# Altium schematic sheet Output.SchDoc
size A; SheetNumber: 6; SheetTotal: 6
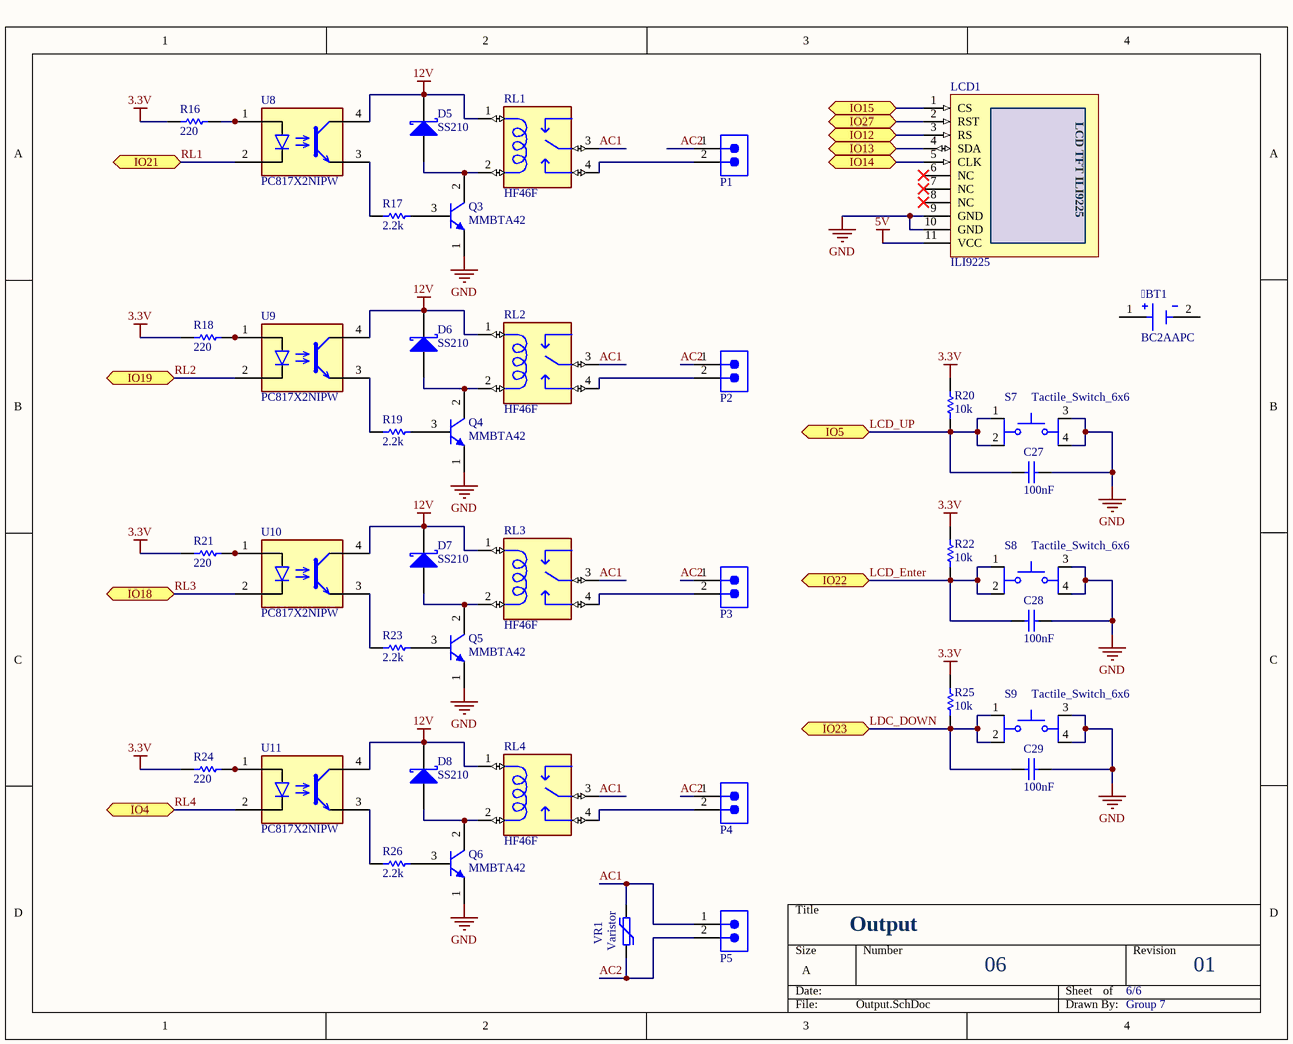
[diagram p0: Output.SchDoc]

## Parts
BT1  BC2AAPC  [BC2AAPC]
C27  100nF  [CAP_0603]
C28  100nF  [CAP_0603]
C29  100nF  [CAP_0603]
D5  SS210  [SS34]
D6  SS210  [SS34]
D7  SS210  [SS34]
D8  SS210  [SS34]
LCD1  ILI9225  [LCD TFT ILI9225]
P1  691322310002  [691322310002]  (value not drawn)
P2  691322310002  [691322310002]  (value not drawn)
P3  691322310002  [691322310002]  (value not drawn)
P4  691322310002  [691322310002]  (value not drawn)
P5  691322310002  [691322310002]  (value not drawn)
Q3  MMBTA42  [SOT23B]
Q4  MMBTA42  [SOT23B]
Q5  MMBTA42  [SOT23B]
Q6  MMBTA42  [SOT23B]
R16  220  [resistor_0603]
R17  2.2k  [resistor_0603]
R18  220  [resistor_0603]
R19  2.2k  [resistor_0603]
R20  10k  [resistor_0603]
R21  220  [resistor_0603]
R22  10k  [resistor_0603]
R23  2.2k  [resistor_0603]
R24  220  [resistor_0603]
R25  10k  [resistor_0603]
R26  2.2k  [resistor_0603]
RL1  HF46F  [HF46F]
RL2  HF46F  [HF46F]
RL3  HF46F  [HF46F]
RL4  HF46F  [HF46F]
S7  Tactile_Switch_6x6  [Tactile_Switch_6x6]
S8  Tactile_Switch_6x6  [Tactile_Switch_6x6]
S9  Tactile_Switch_6x6  [Tactile_Switch_6x6]
U8  PC817X2NIPW  [PC817XI_SHP]
U9  PC817X2NIPW  [PC817XI_SHP]
U10  PC817X2NIPW  [PC817XI_SHP]
U11  PC817X2NIPW  [PC817XI_SHP]
VR1  Varistor  [07D471K]

## Ports
IO4 (bidir), IO5 (bidir), IO12 (bidir), IO13 (bidir), IO14 (bidir), IO15 (bidir), IO18 (bidir), IO19 (bidir), IO21 (bidir), IO22 (bidir), IO23 (bidir), IO27 (bidir)

## Nets
3.3V: R16.1 R18.1 R20.1 R21.1 R22.1 R24.1 R25.1
5V: LCD1.11(VCC)
12V: D5.2(K) D6.2(K) D7.2(K) D8.2(K) RL1.1(C1) RL2.1(C1) RL3.1(C1) RL4.1(C1) U8.4 U9.4 U10.4 U11.4
GND: C27.2 C28.2 C29.2 LCD1.9(GND) LCD1.10(GND) Q3.1(E) Q4.1(E) Q5.1(E) Q6.1(E) S7.3 S7.4 S8.3 S8.4 S9.3 S9.4
AC1: P5.1 RL1.3(C) RL2.3(C) RL3.3(C) RL4.3(C) VR1.1
AC2: P1.1 P2.1 P3.1 P4.1 P5.2 VR1.2
IO12: LCD1.3(RS) ; port IO12
IO13: LCD1.4(SDA) ; port IO13
IO14: LCD1.5(CLK) ; port IO14
IO15: LCD1.1(CS) ; port IO15
IO27: LCD1.2(RST) ; port IO27
LCD_Enter: C28.1 R22.2 S8.1 S8.2 ; port IO22
LCD_UP: C27.1 R20.2 S7.1 S7.2 ; port IO5
LDC_DOWN: C29.1 R25.2 S9.1 S9.2 ; port IO23
RL1: U8.2 ; port IO21
RL2: U9.2 ; port IO19
RL3: U10.2 ; port IO18
RL4: U11.2 ; port IO4
NetD5_1: D5.1(A) Q3.2(C) RL1.2(C2)
NetD6_1: D6.1(A) Q4.2(C) RL2.2(C2)
NetD7_1: D7.1(A) Q5.2(C) RL3.2(C2)
NetD8_1: D8.1(A) Q6.2(C) RL4.2(C2)
NetP1_2: P1.2 RL1.4(NO)
NetP2_2: P2.2 RL2.4(NO)
NetP3_2: P3.2 RL3.4(NO)
NetP4_2: P4.2 RL4.4(NO)
NetQ3_3: Q3.3(B) R17.2
NetQ4_3: Q4.3(B) R19.2
NetQ5_3: Q5.3(B) R23.2
NetQ6_3: Q6.3(B) R26.2
NetR16_2: R16.2 U8.1
NetR17_1: R17.1 U8.3
NetR18_2: R18.2 U9.1
NetR19_1: R19.1 U9.3
NetR21_2: R21.2 U10.1
NetR23_1: R23.1 U10.3
NetR24_2: R24.2 U11.1
NetR26_1: R26.1 U11.3

Not connected (* = marked no-connect by the designer): BT1 1(POS) 2(NEG); LCD1 6(NC)* 7(NC)* 8(NC)*

## Notes on the sheet
- Output
- 06
- 6/6
- 01
- Group 7
- (in symbol LCD TFT) LCD TFT ILI9225

## Library data of the parts
BT1 = CMP-00029-00003-2: Battery Holder Aa 2 Cell Pc Pin; Pins: 2; Supplier Locally URL: https://www.thegioiic.com/hop-pin-2xaa-xuyen-lo-han-pcb; Supplier Locally Name: Thegioiic; Mounting Technology: THT
C27-C29 = 01060310410: CAP, size 0603, 100nF; Supply 1 SN: 885012206095; Supply 1 name: Wurth Elektronik; Supply 2 name: Thegioiic; Capacitance Tolerance: +/-10%; ComponentLink1Description: Manufacturer; ComponentLink1URL: http://www.we-online.de; ComponentLink2Description: Datasheet; ComponentLink2URL: https://www.we-online.com/catalog/datasheet/885012206095.pdf; Operating Temperature: -55 to +125degC; Packaging: Tape and Reel; Supply 1 URL: https://www.we-online.com/en/components/products/WCAP-CSGP-50VDC?sq=885012206095R#885012206095R; Supply 2 SN: *; Supply 2 URL: https://www.thegioiic.com/tu-gom-0603-100nf-0-1uf-50v; Dissipation Factor: *; Height: *; Mounting Technology: SMT; Size: 0603; Capacitance: 100nF; Technical Reference: *
D5-D8 = D Schottky: Schottky Diode; Published: 8-Jun-2000; LatestRevisionDate: 17-Jul-2002; LatestRevisionNote: Re-released for DXP Platform.; PackageReference: SMB; Publisher: Altium Limited; PackageDescription: DO-214-AA/SMB; 2 C-Bend Leads; Body 5.3 x 3.6 mm, inc. leads (LxW); Code_JEDEC: DO-214-AA
LCD1 = LCD TFT: The ILI9225 is a 262,144-color one-chip SoC driver for a-TFT liquid crystal display with resolution of 176RGBx220 dots, comprising a 528-channel source driver, a 220-channel gate driver, 87120 bytes RAM for graphic data of 176RGBx220 dots, and power supply circuit.; Display Color: 16BIT RGB 65K color; Screen Size: 2.2(inch); Resolution: 176*220 (Pixel); Module Interface: 4-wire SPI interface; Backlight: 3 White Led; Active Area: 34.85x43.56 (mm); Module PCB Size: 42.46x67.20 (mm); Operating Voltage: 5V/3.3V; Power Consumption: TBD; Rough Weight(Package containing): 23 (g); SKU: MAR2201; Type: TFT; Driver IC: ILI9225; Operating Temperature: -20℃~60℃; Storage Temperature: -30℃~70℃; ComponentLink1Description: Hshop; ComponentLink1URL: https://hshop.vn/products/man-hinh-lcd-tft-2-inch-ili9225-giao-tiep-spi; ComponentLink2Description: Thegioiic; ComponentLink2URL: https://www.thegioiic.com/lcd-2inch-176x220-tft-ili9225-giao-tiep-spi
P1-P5 = 691322310002: WR-TBL Series 322 Horizontal PCB Header, THT, pitch 3.81mm, 2p; Manufacturer: Wurth Elektronik; Modularity: No; Rated Current: 10A; Working Voltage: 300V; Supply 3 Name: ThegioiIC; ComponentLink1Description: Website Link; ComponentLink1URL: https://www.we-online.com/redexpert/article/691322310002?ad; ComponentLink2Description: Datasheet Link; ComponentLink2URL: https://www.we-online.com/redexpert/spec/691322310002?ad; Manufacturer Part Number: 691322310002; Category: Terminal Blocks; Match Code: WR-TBL; Mount: Through Hole; Operating Temperature Max: 105°C; Operating Temperature Min: -40°C; Packaging: Box; Application: Pluggable; Number of Pins: 2; Number of Rows: 1; Orientation: Horizontal; Pitch: 3.81mm; Supply 1 Name: *; Supply 1 SN: *; Supply 1 URL: *; Supply 2 Name: *; Supply 2 SN: *; Supply 2 URL: *; Supply 3 SN: *; Supply 3 URL 1: https://www.thegioiic.com/kf-3-81-2-r-terminal-block-plug-in-han-pcb-2-chan-cong-3-81mm-300v-10a; Supply 3 URL 2: https://www.thegioiic.com/ul-3-81-2-r-terminal-block-plug-in-han-pcb-2-chan-cong-3-81mm-300v-10a-ulo
Q3-Q6 = BC817: NPN Bipolar Transistor
R16 R18 R21 R24 = 0006032211: RES, 220 Ohm, size 0603, 1%; Resistance Tolerant: +/-1%; Rated Power: 1/4W; Supply 1 Name: Mouser; Supply 1 SN: 667-ERJ-UP3F2200V; Supply 2 Name: Digikey; Supply 2 SN: 10-ERJ-UP3F2200VTR-ND 10-ERJ-UP3F2200VCT-ND 10-ERJ-UP3F2200VDKR-ND; Resistance: 220; Size: 0603; Mounting Technology: SMT; ComponentLink1Description: Datasheet link; ComponentLink1URL: https://api.pim.na.industrial.panasonic.com/file_stream/main/fileversion/4484; ComponentLink2Description: Supply 1 URL; ComponentLink2URL: https://www.mouser.vn/ProductDetail/Panasonic/ERJ-UP3F2200V?qs=sGAEpiMZZMvdGkrng054twq3eZrCFN89E%252BhCXuCu3h8RslmTO1I28Q%3D%3D; ComponentLink3Description: Supply 2 URL; ComponentLink3URL: https://www.digikey.com/en/products/detail/panasonic-electronic-components/ERJ-UP3F2200V/12092129
R17 R19 R23 R26 = 0006032221: RES, 2.2k Ohm, size 0603, 1%; Resistance Tolerant: +/-1%; Rated Power: 1/4W; Supply 1 Name: Mouser; Supply 1 SN: 667-ERJ-UP3F2201V; Supply 2 Name: Digikey; Supply 2 SN: 10-ERJ-UP3F2201VTR-ND 10-ERJ-UP3F2201VCT-ND 10-ERJ-UP3F2201VDKR-ND; Supply 3 Name: thegioiic; Supply 3 SN: NA; Resistance: 2.2k; Size: 0603; Mounting Technology: SMT; ComponentLink1Description: Datasheet link; ComponentLink1URL: https://api.pim.na.industrial.panasonic.com/file_stream/main/fileversion/4484; ComponentLink2Description: Supply 1 URL; ComponentLink2URL: https://www.mouser.vn/ProductDetail/Panasonic/ERJ-UP3F2201V?qs=sGAEpiMZZMvdGkrng054twq3eZrCFN89KeaXYJ5LTWyJgfuuVVfZrw%3D%3D; ComponentLink3Description: Supply 2 URL; ComponentLink3URL: https://www.digikey.com/en/products/detail/panasonic-electronic-components/ERJ-UP3F2201V/12092708; ComponentLink4Description: Supply 3 URL; ComponentLink4URL: https://www.thegioiic.com/dien-tro-2-2-kohm-0603-1
R20 R22 R25 = 0006031031: RES, 10k Ohm, size 0603, 1%; Resistance Tolerant: +/-1%; Rated Power: 1/4W; Supply 1 Name: Mouser; Supply 1 SN: 755-ESR03EZPF1002; Supply 2 Name: Digikey; Supply 2 SN: RHM10KADTR-ND RHM10KADCT-ND RHM10KADDKR-ND; Resistance: 10k; Size: 0603; Mounting Technology: SMT; ComponentLink1Description: Datasheet link; ComponentLink1URL: https://fscdn.rohm.com/en/products/databook/datasheet/passive/resistor/chip_resistor/esr-e.pdf; ComponentLink2Description: Supply 1 URL; ComponentLink2URL: https://www.mouser.vn/ProductDetail/ROHM-Semiconductor/ESR03EZPF1002?qs=sGAEpiMZZMvdGkrng054t67Efho1F8r6CDeAsqwFse8%3D; ComponentLink3Description: Supply 2 URL; ComponentLink3URL: https://www.digikey.com/en/products/detail/rohm-semiconductor/ESR03EZPF1002/1983429
RL1-RL4 = HF46F: SeriesHF46F 12V 1 Form A 1A Gold Plated SUBMINIATURE INTERMEDIATE POWER RELAY; MF: Hongfa; Package: None; Price: None; Value: *; SnapEDA_Link: https://www.snapeda.com/parts/HF46F/Hongfa/view-part/?ref=snap; MP: HF46F; Availability: Not in stock; Check_prices: https://www.snapeda.com/parts/HF46F/Hongfa/view-part/?ref=eda
S7-S9 = Tactile_Switch_6x6: Tactile Switch, 6x6mm
U8-U11 = PC817X2NIPW: PC817 series, SMD, I_F (max) = 500mA, V_F (max) = 1.4V. / Breakdown voltage: BV_CE = 80V, BV_BE = 6V.
VR1 = 07D471K 470V